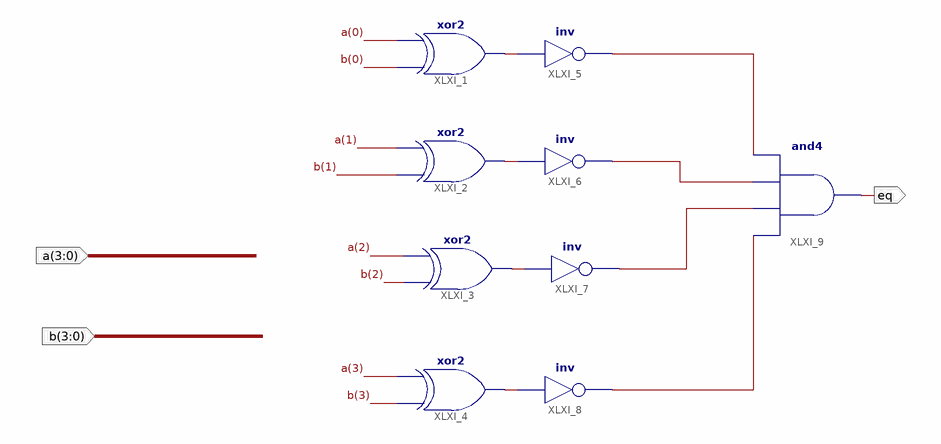
[diagram p0: schematic sheet 1]
// Xilinx ISE schematic COMP4.sch (artix7) as structural Verilog: 9 symbols, 3 ports
module COMP4 (
  input  [3:0] a,
  input  [3:0] b,
  output eq
);

  wire XLXN_4, XLXN_5, XLXN_6, XLXN_7, XLXN_8, XLXN_9, XLXN_10, XLXN_11;

  xor XLXI_1 (XLXN_4, b[0], a[0]);
  xor XLXI_2 (XLXN_5, b[1], a[1]);
  xor XLXI_3 (XLXN_6, b[2], a[2]);
  xor XLXI_4 (XLXN_7, b[3], a[3]);
  not XLXI_5 (XLXN_11, XLXN_4);
  not XLXI_6 (XLXN_8, XLXN_5);
  not XLXI_7 (XLXN_9, XLXN_6);
  not XLXI_8 (XLXN_10, XLXN_7);
  and XLXI_9 (eq, XLXN_10, XLXN_9, XLXN_8, XLXN_11);
endmodule
